# Altium schematic sheet fpgea_ep4c_f23_test.SchDoc: =GlobalProjectName
size A1; SheetNumber: Лист; SheetTotal: Листов; PageSetup: Record=PageOptions|CenterHorizontal=True|CenterVertical=True|PrintScale=1.00|XCorrection=1.00|YCorrection=1.00|PrintKind=1|BorderSize=5000000|LeftOffset=0|BottomOffset=0|Orientation=2|PaperLength=1000|PaperWidth=1000|Scale=100|PaperSource=15|PrintQuality=1200|MediaType=1|DitherType=10|PaperKind=A3|PrintScaleMode=1; Weight: -; ScaleFactor: -
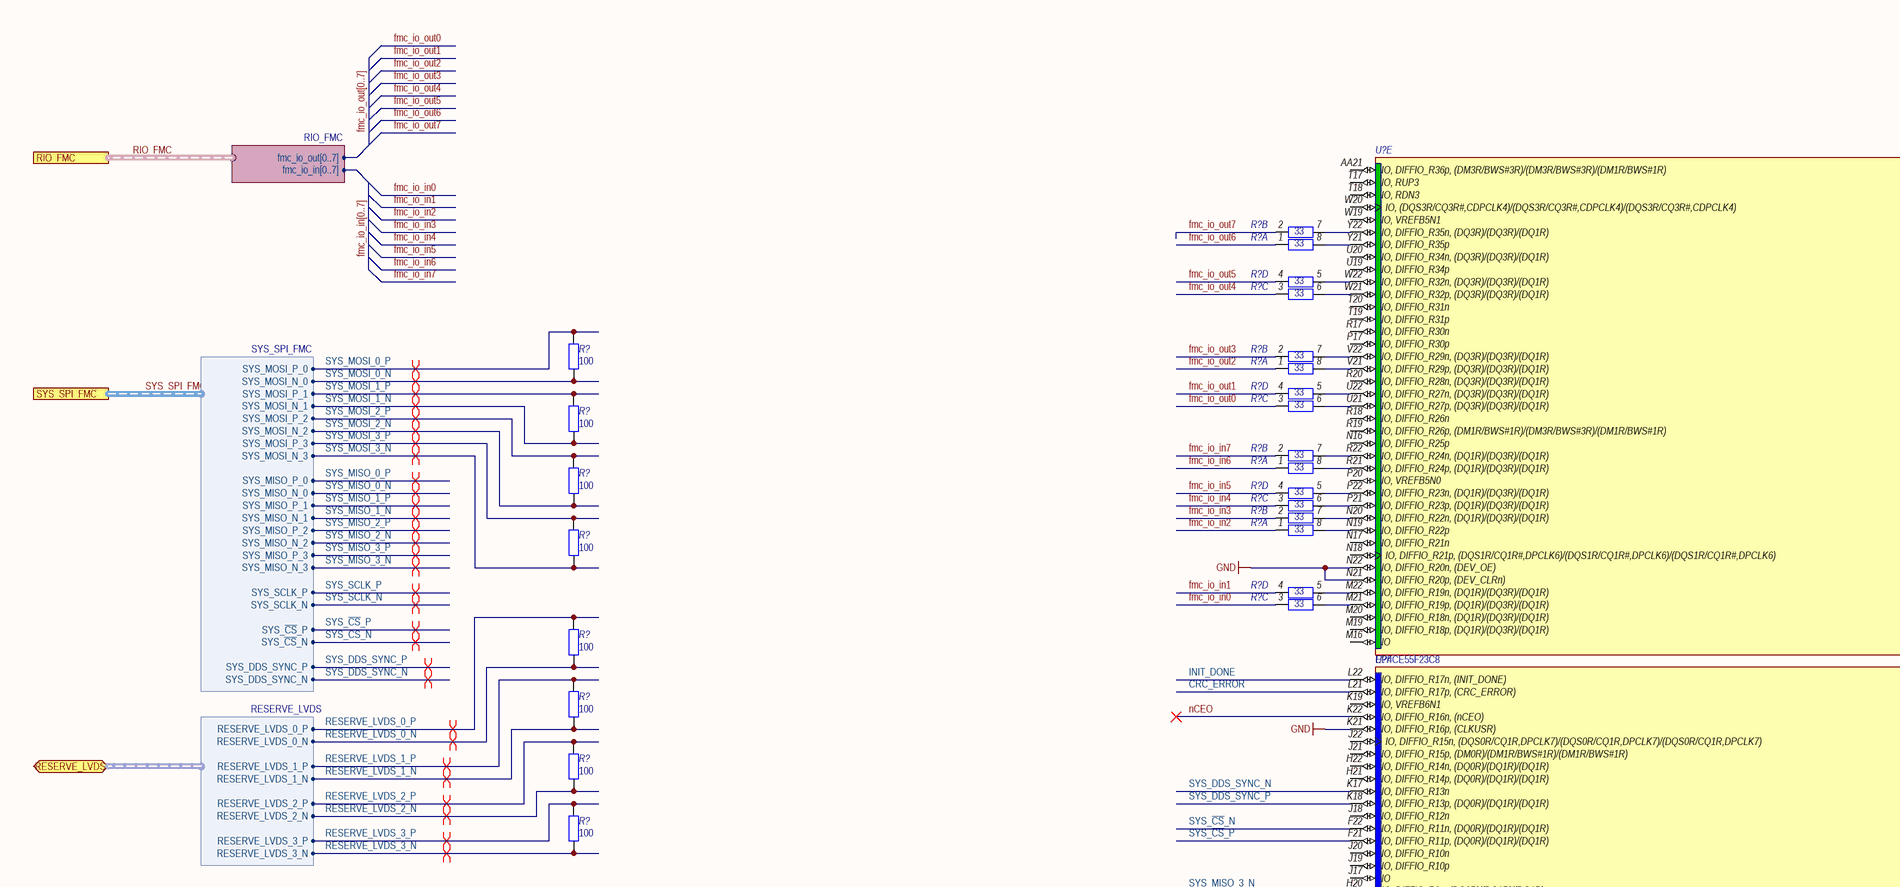
[diagram p0: fpgea_ep4c_f23_test.SchDoc, top left]
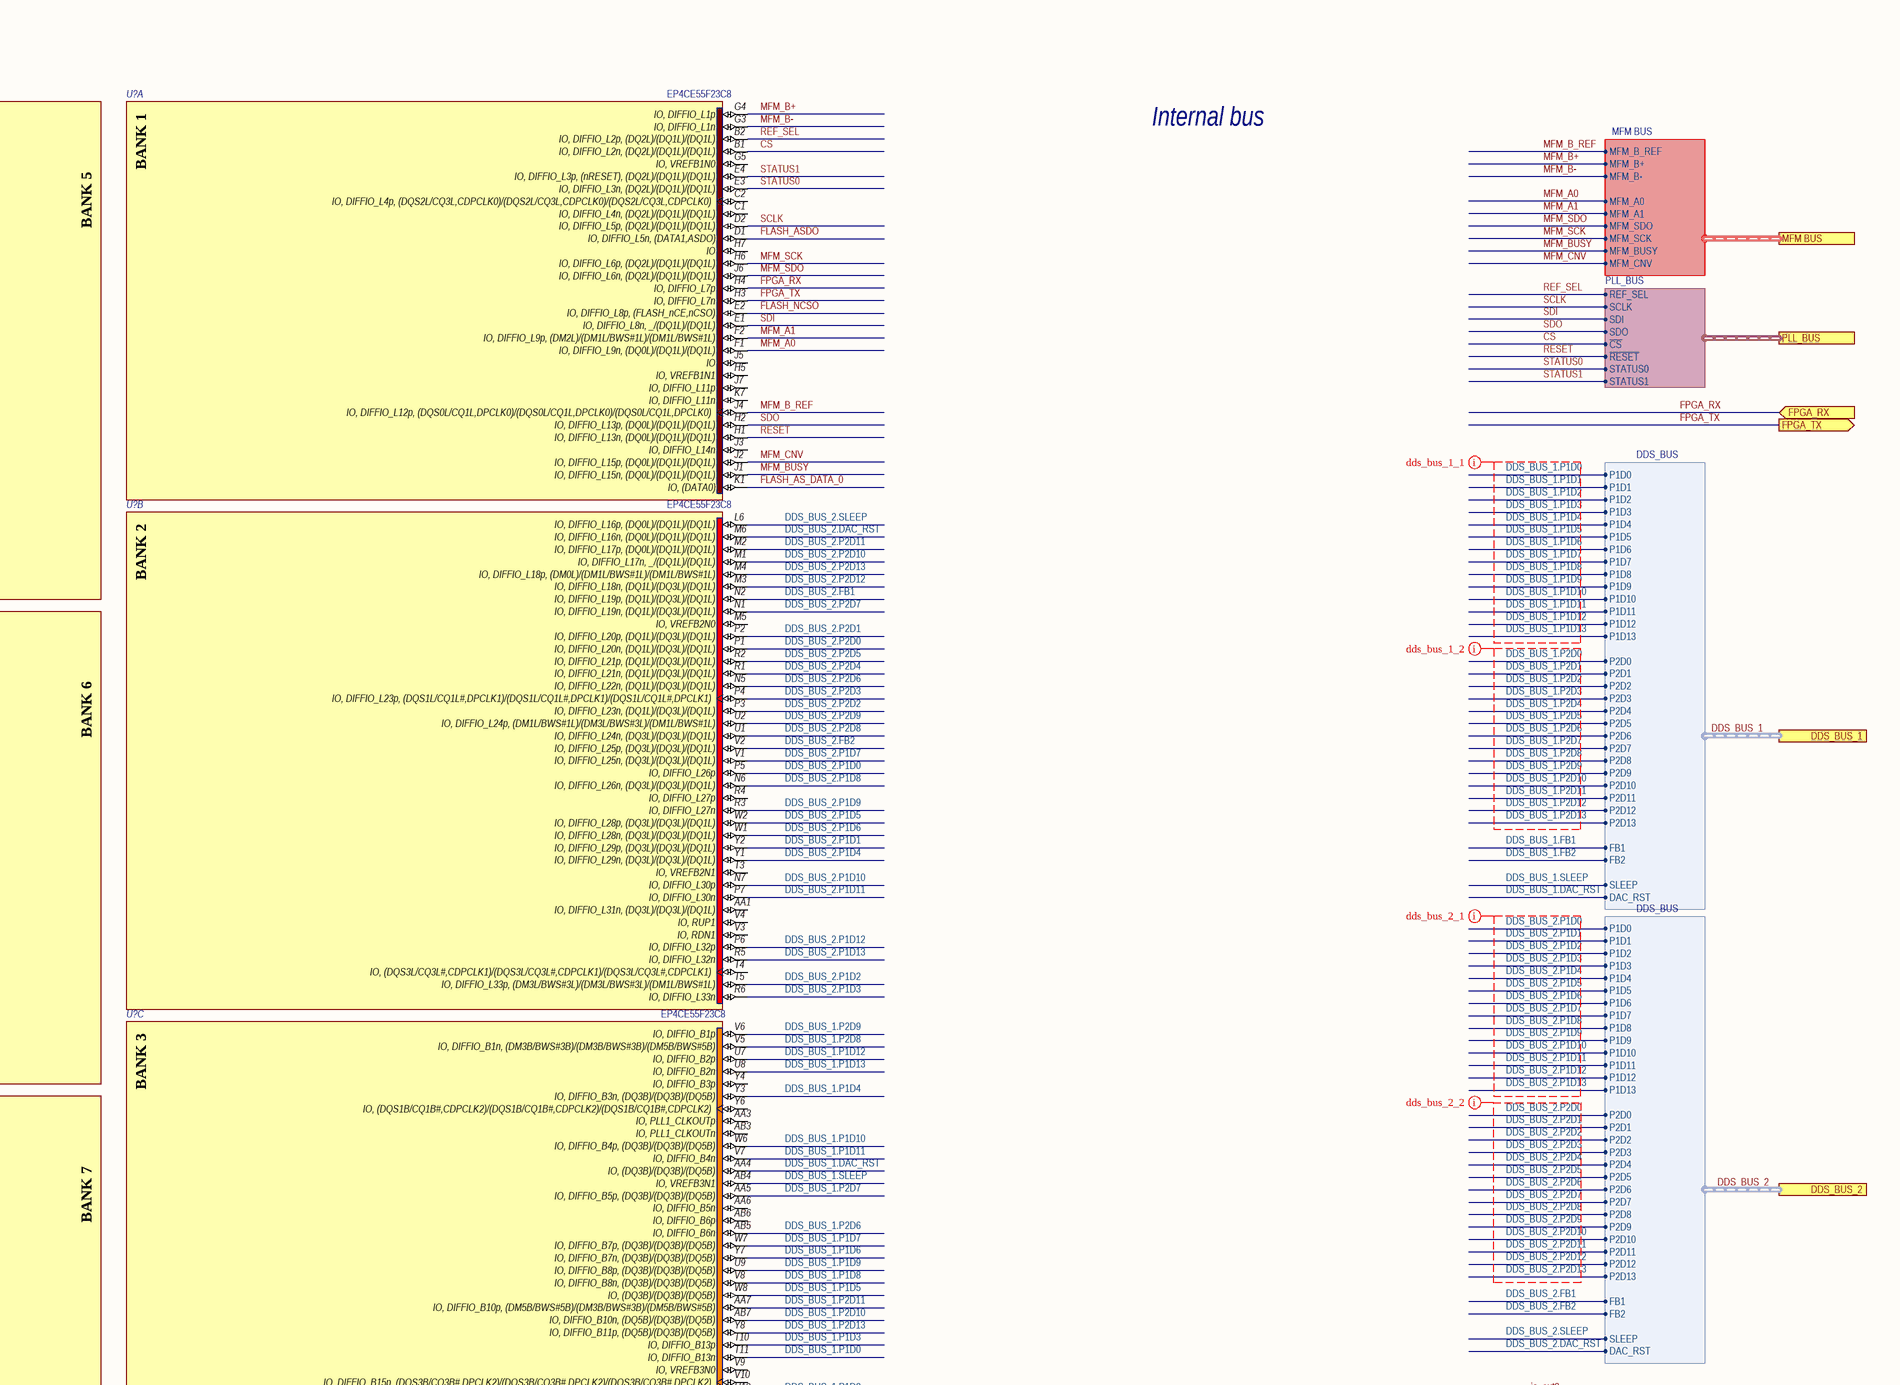
[diagram p1: fpgea_ep4c_f23_test.SchDoc, top right]
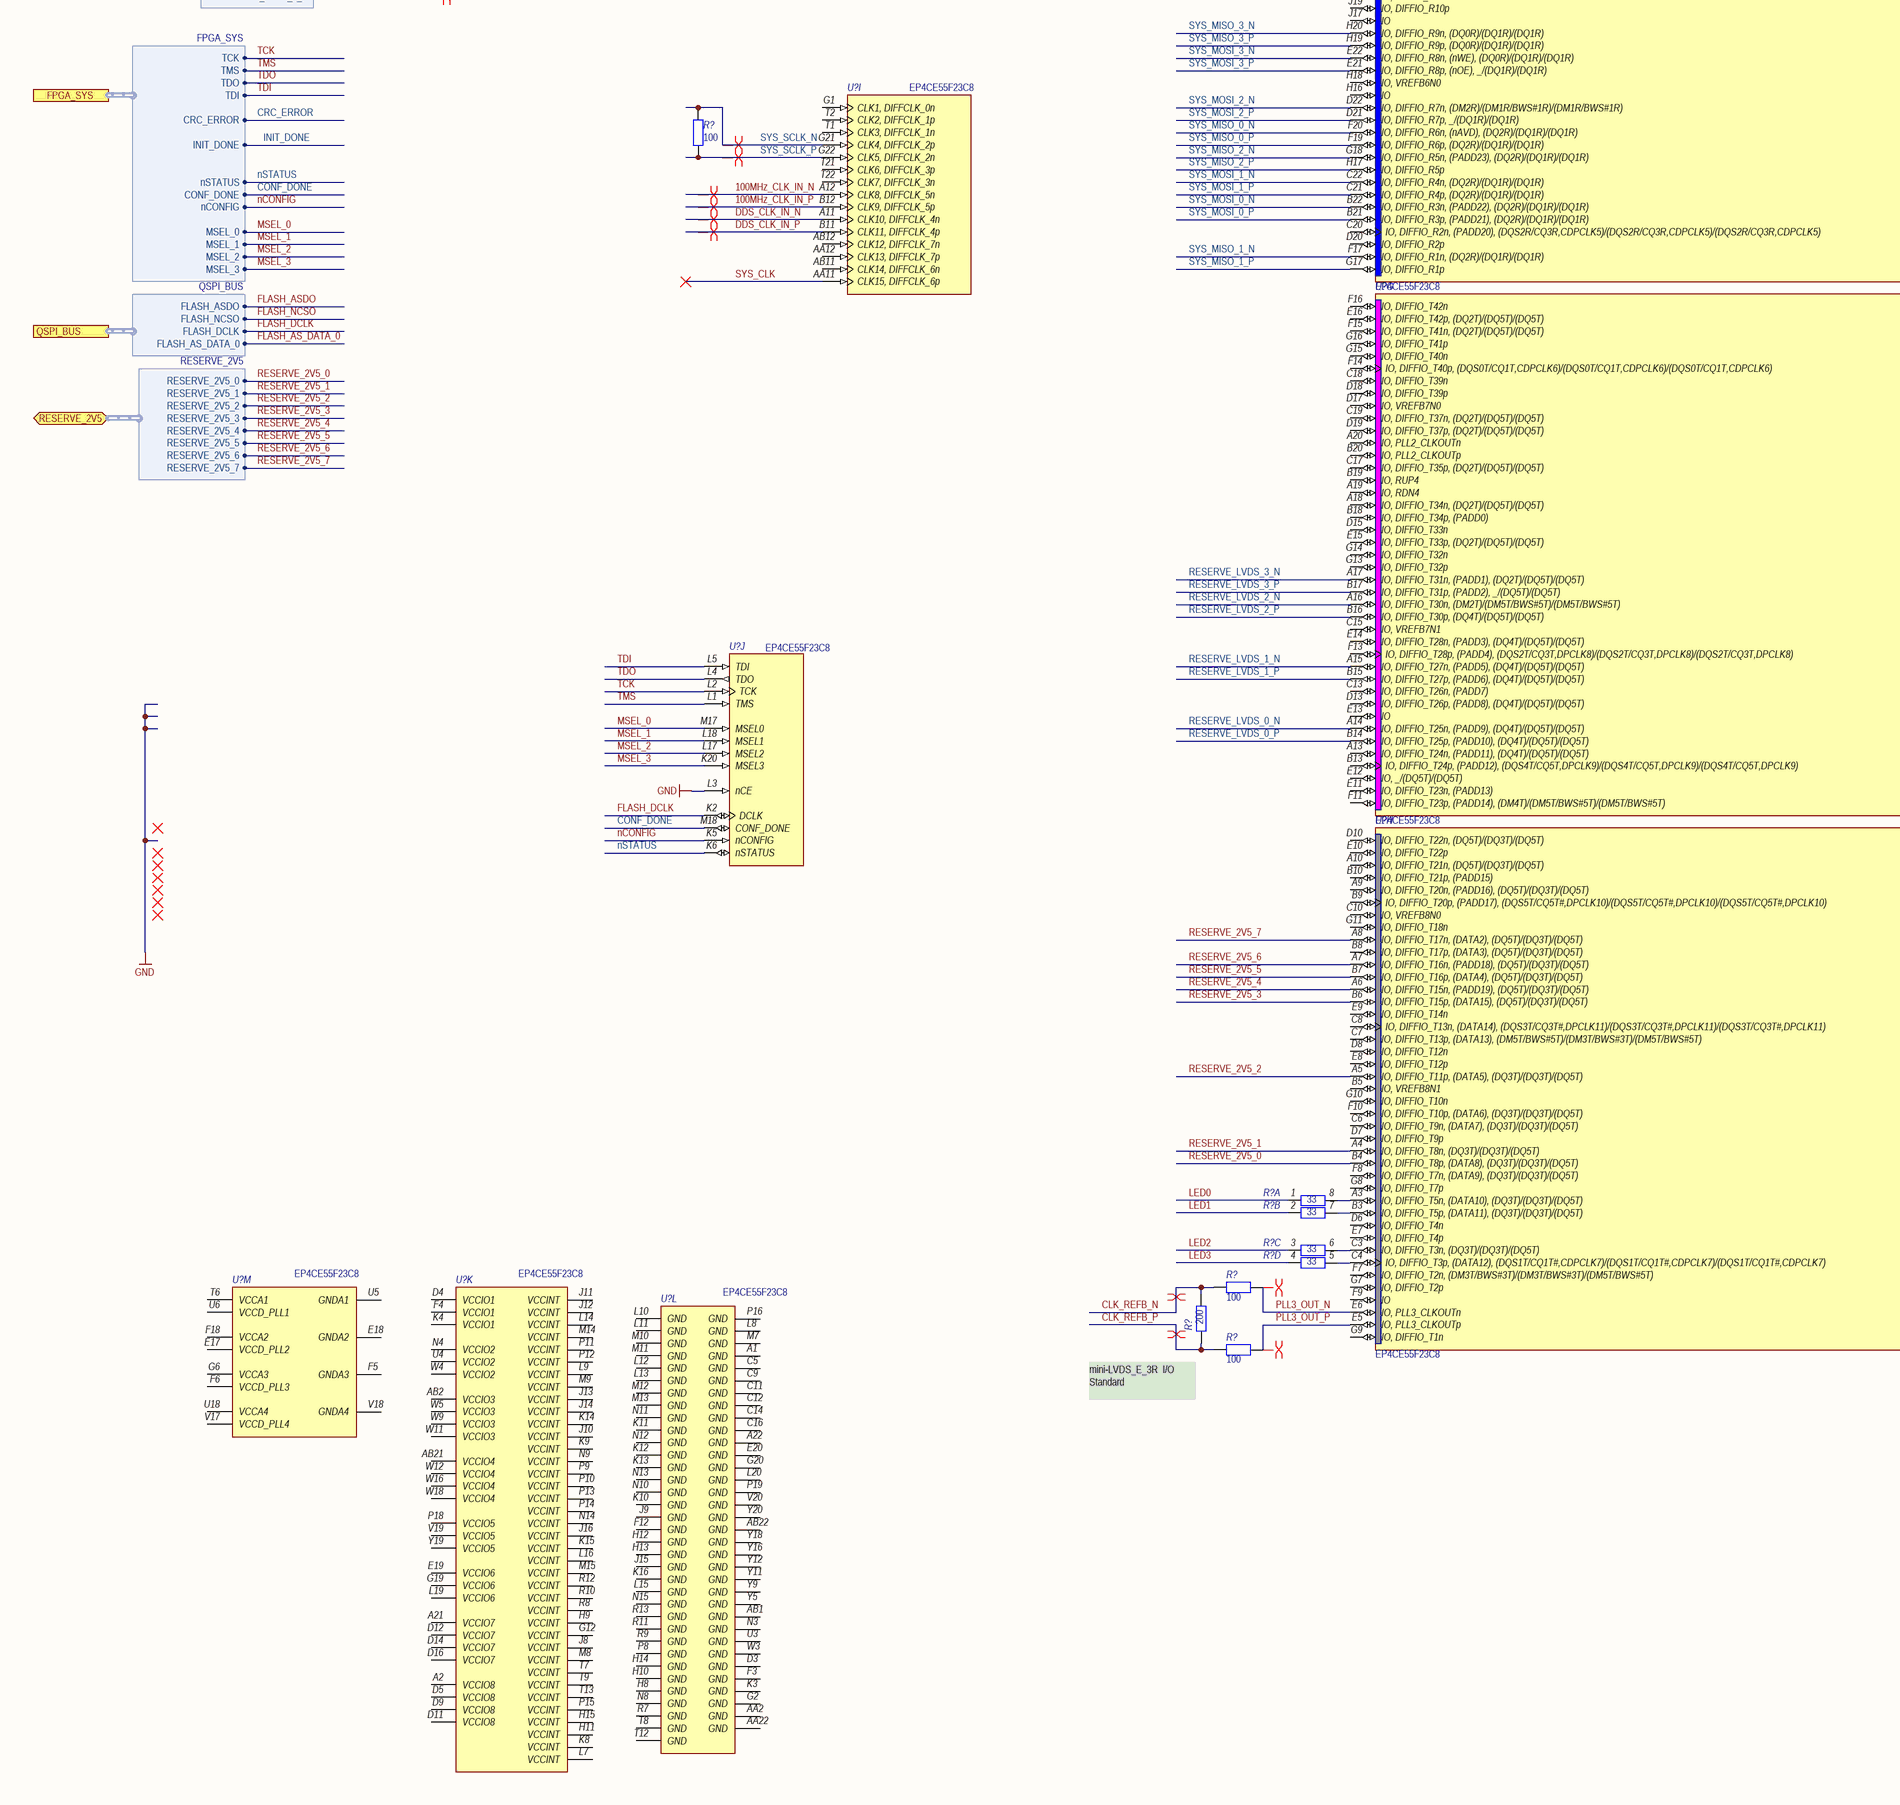
[diagram p2: fpgea_ep4c_f23_test.SchDoc, bottom left]
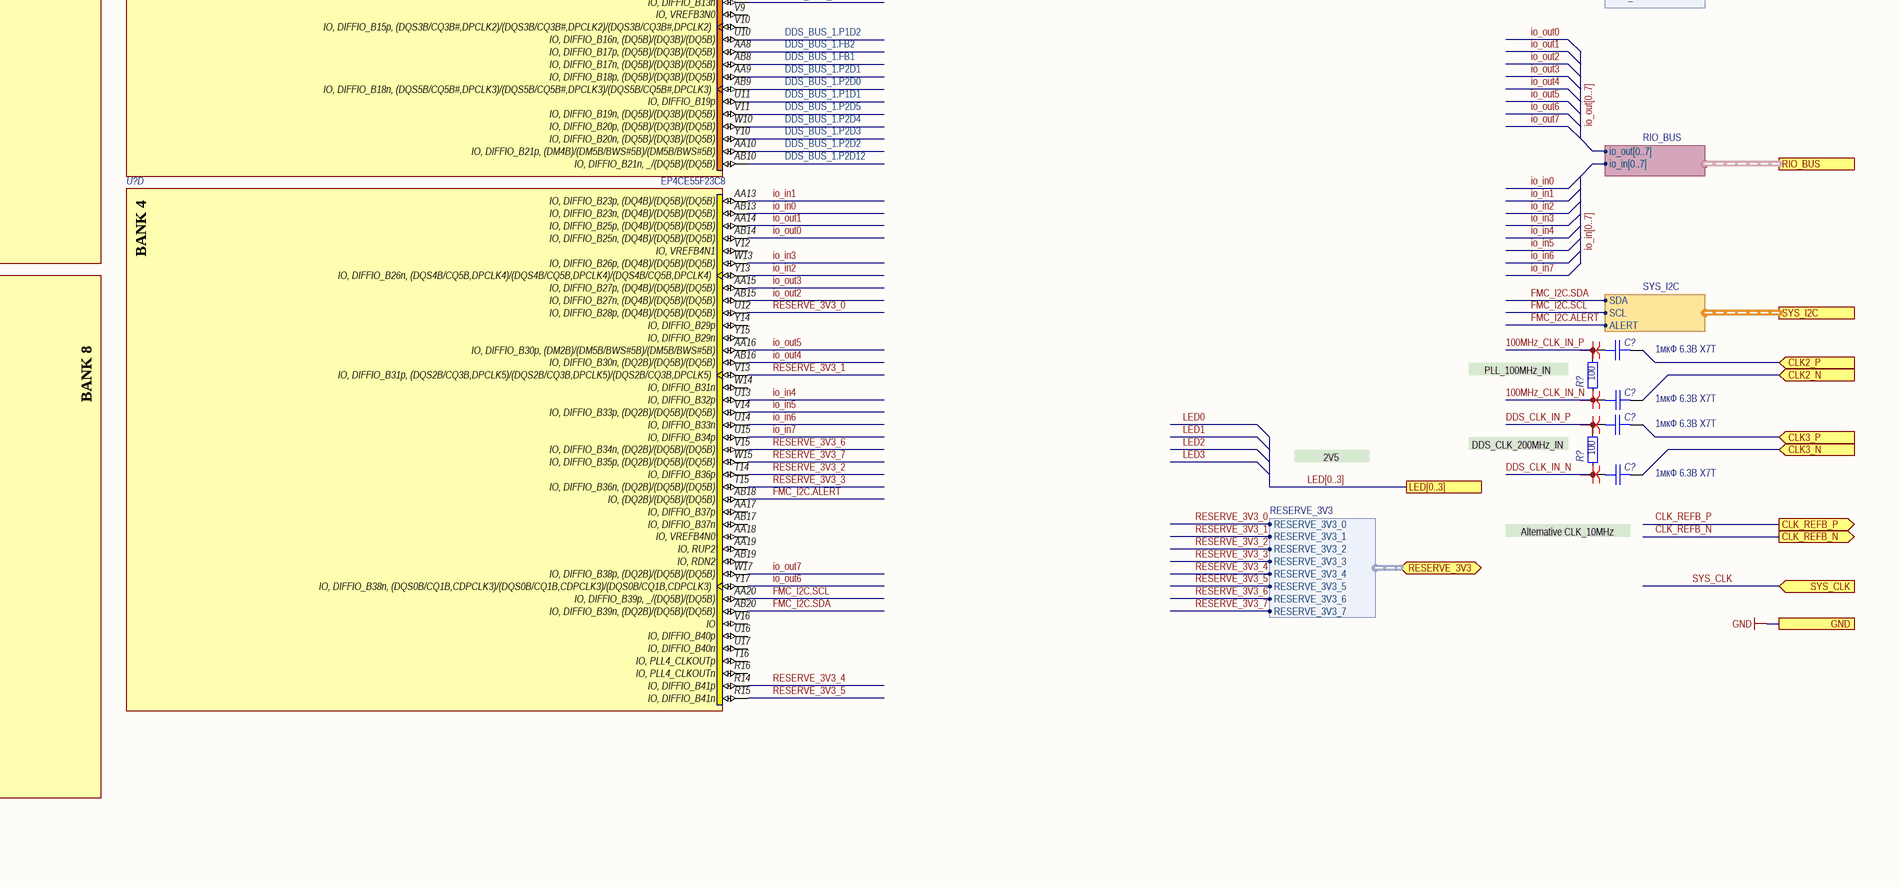
[diagram p3: fpgea_ep4c_f23_test.SchDoc, bottom right]

## Parts
(Parts that share a designator on the sheet are numbered #1, #2 ... from top to bottom, then left to right.)
C?#1  1мкФ 6.3В X7T  [SMD_C0603]
C?#2  1мкФ 6.3В X7T  [SMD_C0603]
C?#3  1мкФ 6.3В X7T  [SMD_C0603]
C?#4  1мкФ 6.3В X7T  [SMD_C0603]
R?#1  value 33  [TC124]  (hidden comment: 4 Chip Resistor Array)  (part B of 4)
R?#2  value 33  [TC124]  (hidden comment: 4 Chip Resistor Array)  (part A of 4)
R?#3  value 33  [TC124]  (hidden comment: 4 Chip Resistor Array)  (part D of 4)
R?#4  value 33  [TC124]  (hidden comment: 4 Chip Resistor Array)  (part C of 4)
R?#5  100  [SMD_0603]
R?#6  value 33  [TC124]  (hidden comment: 4 Chip Resistor Array)  (part B of 4)
R?#7  value 33  [TC124]  (hidden comment: 4 Chip Resistor Array)  (part A of 4)
R?#8  value 33  [TC124]  (hidden comment: 4 Chip Resistor Array)  (part D of 4)
R?#9  value 33  [TC124]  (hidden comment: 4 Chip Resistor Array)  (part C of 4)
R?#10  100  [SMD_0603]
R?#11  value 33  [TC124]  (hidden comment: 4 Chip Resistor Array)  (part B of 4)
R?#12  value 33  [TC124]  (hidden comment: 4 Chip Resistor Array)  (part A of 4)
R?#13  100  [SMD_0603]
R?#14  value 33  [TC124]  (hidden comment: 4 Chip Resistor Array)  (part D of 4)
R?#15  value 33  [TC124]  (hidden comment: 4 Chip Resistor Array)  (part C of 4)
R?#16  value 33  [TC124]  (hidden comment: 4 Chip Resistor Array)  (part B of 4)
R?#17  value 33  [TC124]  (hidden comment: 4 Chip Resistor Array)  (part A of 4)
R?#18  100  [SMD_0603]
R?#19  value 33  [TC124]  (hidden comment: 4 Chip Resistor Array)  (part D of 4)
R?#20  value 33  [TC124]  (hidden comment: 4 Chip Resistor Array)  (part C of 4)
R?#21  100  [SMD_0603]
R?#22  100  [SMD_0603]
R?#23  100  [SMD_0603]
R?#24  100  [SMD_0603]
R?#25  100  [SMD_0603]
R?#26  100  [SMD_0603]
R?#27  100  [SMD_0603]
R?#28  value 33  [TC124]  (hidden comment: 4 Chip Resistor Array)  (part A of 4)
R?#29  value 33  [TC124]  (hidden comment: 4 Chip Resistor Array)  (part B of 4)
R?#30  value 33  [TC124]  (hidden comment: 4 Chip Resistor Array)  (part C of 4)
R?#31  value 33  [TC124]  (hidden comment: 4 Chip Resistor Array)  (part D of 4)
R?#32  100  [SMD_0603]
R?#33  200  [SMD_0603]
R?#34  100  [SMD_0603]
U?#1  EP4CE55F23C8  [PCBComponent_1]  (part E of 13)
U?#2  EP4CE55F23C8  [PCBComponent_1]  (part A of 13)
U?#3  EP4CE55F23C8  [PCBComponent_1]  (part B of 13)
U?#4  EP4CE55F23C8  [PCBComponent_1]  (part F of 13)
U?#5  EP4CE55F23C8  [PCBComponent_1]  (part I of 13)
U?#6  EP4CE55F23C8  [PCBComponent_1]  (part C of 13)
U?#7  EP4CE55F23C8  [PCBComponent_1]  (part G of 13)
U?#8  EP4CE55F23C8  [PCBComponent_1]  (part J of 13)
U?#9  EP4CE55F23C8  [PCBComponent_1]  (part D of 13)
U?#10  EP4CE55F23C8  [PCBComponent_1]  (part H of 13)
U?#11  EP4CE55F23C8  [PCBComponent_1]  (part M of 13)
U?#12  EP4CE55F23C8  [PCBComponent_1]  (part K of 13)
U?#13  EP4CE55F23C8  [PCBComponent_1]  (part L of 13)

## Ports
CLK2_N (in), CLK2_P (in), CLK3_N (in), CLK3_P (in), CLK_REFB_N (out), CLK_REFB_P (out), DDS_BUS_1 (harness DDS_BUS), DDS_BUS_2 (harness DDS_BUS), FPGA_RX (in), FPGA_SYS (harness FPGA_SYS), FPGA_TX (out), GND, LED[0..3], MFM BUS (harness MFM BUS), PLL_BUS (harness PLL_BUS), QSPI_BUS (harness QSPI_BUS), RESERVE_2V5 (bidir, harness RESERVE_2V5), RESERVE_3V3 (bidir, harness RESERVE_3V3), RESERVE_LVDS (bidir, harness RESERVE_LVDS), RIO_BUS (harness RIO_BUS), RIO_FMC (harness RIO_FMC), SYS_CLK (in), SYS_I2C (harness SYS_I2C), SYS_SPI_FMC (harness SYS_SPI_FMC)

## Harnesses
MFM BUS: MFM_A0, MFM_A1, MFM_SDO, MFM_SCK, MFM_BUSY, MFM_CNV, MFM_B_REF, MFM_B+, MFM_B-
SYS_I2C: SDA, SCL, ALERT
PLL_BUS: REF_SEL, SCLK, SDI, SDO, ~{CS}, ~{RESET}, STATUS0, STATUS1
RIO_BUS: io_out[0..7], io_in[0..7]
RESERVE_3V3: RESERVE_3V3_0, RESERVE_3V3_1, RESERVE_3V3_2, RESERVE_3V3_3, RESERVE_3V3_4, RESERVE_3V3_5, RESERVE_3V3_6, RESERVE_3V3_7
DDS_BUS: P1D0, P1D1, P1D2, P1D3, P1D4, P1D5, P1D6, P1D7, P1D8, P1D9, P1D10, P1D11, P1D12, P1D13, P2D0, P2D1, P2D2, P2D3, P2D4, P2D5, P2D6, P2D7, P2D8, P2D9, P2D10, P2D11, P2D12, P2D13, FB1, SLEEP, DAC_RST, FB2
RIO_FMC: fmc_io_out[0..7], fmc_io_in[0..7]
FPGA_SYS: TCK, TMS, TDO, TDI, CRC_ERROR, nSTATUS, CONF_DONE, nCONFIG, MSEL_0, MSEL_1, MSEL_2, MSEL_3, INIT_DONE
SYS_SPI_FMC: SYS_MOSI_P_0, SYS_SCLK_P, SYS_~{CS}_P, SYS_MOSI_P_1, SYS_MOSI_P_2, SYS_MOSI_P_3, SYS_MOSI_N_0, SYS_MOSI_N_1, SYS_MOSI_N_2, SYS_MOSI_N_3, SYS_MISO_P_0, SYS_MISO_P_1, SYS_MISO_P_2, SYS_MISO_P_3, SYS_MISO_N_0, SYS_MISO_N_1, SYS_MISO_N_2, SYS_MISO_N_3, SYS_SCLK_N, SYS_DDS_SYNC_P, SYS_~{CS}_N, SYS_DDS_SYNC_N
RESERVE_LVDS: RESERVE_LVDS_0_P, RESERVE_LVDS_0_N, RESERVE_LVDS_1_P, RESERVE_LVDS_1_N, RESERVE_LVDS_2_P, RESERVE_LVDS_2_N, RESERVE_LVDS_3_P, RESERVE_LVDS_3_N
QSPI_BUS: FLASH_ASDO, FLASH_NCSO, FLASH_DCLK, FLASH_AS_DATA_0
RESERVE_2V5: RESERVE_2V5_0, RESERVE_2V5_1, RESERVE_2V5_2, RESERVE_2V5_3, RESERVE_2V5_4, RESERVE_2V5_5, RESERVE_2V5_6, RESERVE_2V5_7

## Nets
GND: U?#1.N21(IO,_DIFFIO_R20p,_(DEV_CLRn)) U?#1.N22(IO,_DIFFIO_R20n,_(DEV_OE)) U?#4.K21(IO,_DIFFIO_R16p,_(CLKUSR)) U?#8.L3(nCE) ; port GND
100MHz_CLK_IN_N: C?#2.1 R?#26.1 U?#5.A12(CLK8,_DIFFCLK_5n)
100MHz_CLK_IN_P: C?#1.2 R?#26.2 U?#5.B12(CLK9,_DIFFCLK_5p)
~{CS}: U?#2.B1(IO,_DIFFIO_L2n,_(DQ2L)/(DQ1L)/(DQ1L)) ; port PLL_BUS.~{CS}
CLK2_N: C?#2.2 ; port CLK2_N
CLK2_P: C?#1.1 ; port CLK2_P
CLK3_N: C?#4.2 ; port CLK3_N
CLK3_P: C?#3.1 ; port CLK3_P
CLK_REFB_N: R?#32.2 R?#33.2 ; port CLK_REFB_N
CLK_REFB_P: R?#33.1 R?#34.2 ; port CLK_REFB_P
CONF_DONE: U?#8.M18(CONF_DONE) ; port FPGA_SYS.CONF_DONE
CRC_ERROR: U?#4.L21(IO,_DIFFIO_R17p,_(CRC_ERROR)) ; port FPGA_SYS.CRC_ERROR
DDS_BUS_1.DAC_RST: U?#6.AA4(IO,_(DQ3B)/(DQ3B)/(DQ5B)) ; port DDS_BUS_1.DAC_RST
DDS_BUS_1.FB1: U?#6.AB8(IO,_DIFFIO_B17n,_(DQ5B)/(DQ3B)/(DQ5B)) ; port DDS_BUS_1.FB1
DDS_BUS_1.FB2: U?#6.AA8(IO,_DIFFIO_B17p,_(DQ5B)/(DQ3B)/(DQ5B)) ; port DDS_BUS_1.FB2
DDS_BUS_1.P1D0: U?#6.T11(IO,_DIFFIO_B13n) ; port DDS_BUS_1.P1D0
DDS_BUS_1.P1D1: U?#6.U11(IO,_DIFFIO_B19p) ; port DDS_BUS_1.P1D1
DDS_BUS_1.P1D2: U?#6.U10(IO,_DIFFIO_B16n,_(DQ5B)/(DQ3B)/(DQ5B)) ; port DDS_BUS_1.P1D2
DDS_BUS_1.P1D3: U?#6.T10(IO,_DIFFIO_B13p) ; port DDS_BUS_1.P1D3
DDS_BUS_1.P1D4: U?#6.Y3(IO,_DIFFIO_B3n,_(DQ3B)/(DQ3B)/(DQ5B)) ; port DDS_BUS_1.P1D4
DDS_BUS_1.P1D5: U?#6.W8(IO,_(DQ3B)/(DQ3B)/(DQ5B)) ; port DDS_BUS_1.P1D5
DDS_BUS_1.P1D6: U?#6.Y7(IO,_DIFFIO_B7n,_(DQ3B)/(DQ3B)/(DQ5B)) ; port DDS_BUS_1.P1D6
DDS_BUS_1.P1D7: U?#6.W7(IO,_DIFFIO_B7p,_(DQ3B)/(DQ3B)/(DQ5B)) ; port DDS_BUS_1.P1D7
DDS_BUS_1.P1D8: U?#6.V8(IO,_DIFFIO_B8n,_(DQ3B)/(DQ3B)/(DQ5B)) ; port DDS_BUS_1.P1D8
DDS_BUS_1.P1D9: U?#6.U9(IO,_DIFFIO_B8p,_(DQ3B)/(DQ3B)/(DQ5B)) ; port DDS_BUS_1.P1D9
DDS_BUS_1.P1D10: U?#6.W6(IO,_DIFFIO_B4p,_(DQ3B)/(DQ3B)/(DQ5B)) ; port DDS_BUS_1.P1D10
DDS_BUS_1.P1D11: U?#6.V7(IO,_DIFFIO_B4n) ; port DDS_BUS_1.P1D11
DDS_BUS_1.P1D12: U?#6.U7(IO,_DIFFIO_B2p) ; port DDS_BUS_1.P1D12
DDS_BUS_1.P1D13: U?#6.U8(IO,_DIFFIO_B2n) ; port DDS_BUS_1.P1D13
DDS_BUS_1.P2D0: U?#6.AB9(IO,_DIFFIO_B18n,_(DQS5B/CQ5B#,DPCLK3)/(DQS5B/CQ5B#,DPCLK3)/(DQS5B/CQ5B#,DPCLK3)) ; port DDS_BUS_1.P2D0
DDS_BUS_1.P2D1: U?#6.AA9(IO,_DIFFIO_B18p,_(DQ5B)/(DQ3B)/(DQ5B)) ; port DDS_BUS_1.P2D1
DDS_BUS_1.P2D2: U?#6.AA10(IO,_DIFFIO_B21p,_(DM4B)/(DM5B/BWS#5B)/(DM5B/BWS#5B)) ; port DDS_BUS_1.P2D2
DDS_BUS_1.P2D3: U?#6.Y10(IO,_DIFFIO_B20n,_(DQ5B)/(DQ3B)/(DQ5B)) ; port DDS_BUS_1.P2D3
DDS_BUS_1.P2D4: U?#6.W10(IO,_DIFFIO_B20p,_(DQ5B)/(DQ3B)/(DQ5B)) ; port DDS_BUS_1.P2D4
DDS_BUS_1.P2D5: U?#6.V11(IO,_DIFFIO_B19n,_(DQ5B)/(DQ3B)/(DQ5B)) ; port DDS_BUS_1.P2D5
DDS_BUS_1.P2D6: U?#6.AB5(IO,_DIFFIO_B6n) ; port DDS_BUS_1.P2D6
DDS_BUS_1.P2D7: U?#6.AA5(IO,_DIFFIO_B5p,_(DQ3B)/(DQ3B)/(DQ5B)) ; port DDS_BUS_1.P2D7
DDS_BUS_1.P2D8: U?#6.V5(IO,_DIFFIO_B1n,_(DM3B/BWS#3B)/(DM3B/BWS#3B)/(DM5B/BWS#5B)) ; port DDS_BUS_1.P2D8
DDS_BUS_1.P2D9: U?#6.V6(IO,_DIFFIO_B1p) ; port DDS_BUS_1.P2D9
DDS_BUS_1.P2D10: U?#6.AB7(IO,_DIFFIO_B10n,_(DQ5B)/(DQ3B)/(DQ5B)) ; port DDS_BUS_1.P2D10
DDS_BUS_1.P2D11: U?#6.AA7(IO,_DIFFIO_B10p,_(DM5B/BWS#5B)/(DM3B/BWS#3B)/(DM5B/BWS#5B)) ; port DDS_BUS_1.P2D11
DDS_BUS_1.P2D12: U?#6.AB10(IO,_DIFFIO_B21n,__/(DQ5B)/(DQ5B)) ; port DDS_BUS_1.P2D12
DDS_BUS_1.P2D13: U?#6.Y8(IO,_DIFFIO_B11p,_(DQ5B)/(DQ3B)/(DQ5B)) ; port DDS_BUS_1.P2D13
DDS_BUS_1.SLEEP: U?#6.AB4(IO,_VREFB3N1) ; port DDS_BUS_1.SLEEP
DDS_BUS_2.DAC_RST: U?#3.M6(IO,_DIFFIO_L16n,_(DQ0L)/(DQ1L)/(DQ1L)) ; port DDS_BUS_2.DAC_RST
DDS_BUS_2.FB1: U?#3.N2(IO,_DIFFIO_L19p,_(DQ1L)/(DQ3L)/(DQ1L)) ; port DDS_BUS_2.FB1
DDS_BUS_2.FB2: U?#3.V2(IO,_DIFFIO_L25p,_(DQ3L)/(DQ3L)/(DQ1L)) ; port DDS_BUS_2.FB2
DDS_BUS_2.P1D0: U?#3.P5(IO,_DIFFIO_L26p) ; port DDS_BUS_2.P1D0
DDS_BUS_2.P1D1: U?#3.Y2(IO,_DIFFIO_L29p,_(DQ3L)/(DQ3L)/(DQ1L)) ; port DDS_BUS_2.P1D1
DDS_BUS_2.P1D2: U?#3.T5(IO,_DIFFIO_L33p,_(DM3L/BWS#3L)/(DM3L/BWS#3L)/(DM1L/BWS#1L)) ; port DDS_BUS_2.P1D2
DDS_BUS_2.P1D3: U?#3.R6(IO,_DIFFIO_L33n) ; port DDS_BUS_2.P1D3
DDS_BUS_2.P1D4: U?#3.Y1(IO,_DIFFIO_L29n,_(DQ3L)/(DQ3L)/(DQ1L)) ; port DDS_BUS_2.P1D4
DDS_BUS_2.P1D5: U?#3.W2(IO,_DIFFIO_L28p,_(DQ3L)/(DQ3L)/(DQ1L)) ; port DDS_BUS_2.P1D5
DDS_BUS_2.P1D6: U?#3.W1(IO,_DIFFIO_L28n,_(DQ3L)/(DQ3L)/(DQ1L)) ; port DDS_BUS_2.P1D6
DDS_BUS_2.P1D7: U?#3.V1(IO,_DIFFIO_L25n,_(DQ3L)/(DQ3L)/(DQ1L)) ; port DDS_BUS_2.P1D7
DDS_BUS_2.P1D8: U?#3.N6(IO,_DIFFIO_L26n,_(DQ3L)/(DQ3L)/(DQ1L)) ; port DDS_BUS_2.P1D8
DDS_BUS_2.P1D9: U?#3.R3(IO,_DIFFIO_L27n) ; port DDS_BUS_2.P1D9
DDS_BUS_2.P1D10: U?#3.N7(IO,_DIFFIO_L30p) ; port DDS_BUS_2.P1D10
DDS_BUS_2.P1D11: U?#3.P7(IO,_DIFFIO_L30n) ; port DDS_BUS_2.P1D11
DDS_BUS_2.P1D12: U?#3.P6(IO,_DIFFIO_L32p) ; port DDS_BUS_2.P1D12
DDS_BUS_2.P1D13: U?#3.R5(IO,_DIFFIO_L32n) ; port DDS_BUS_2.P1D13
DDS_BUS_2.P2D0: U?#3.P1(IO,_DIFFIO_L20n,_(DQ1L)/(DQ3L)/(DQ1L)) ; port DDS_BUS_2.P2D0
DDS_BUS_2.P2D1: U?#3.P2(IO,_DIFFIO_L20p,_(DQ1L)/(DQ3L)/(DQ1L)) ; port DDS_BUS_2.P2D1
DDS_BUS_2.P2D2: U?#3.P3(IO,_DIFFIO_L23n,_(DQ1L)/(DQ3L)/(DQ1L)) ; port DDS_BUS_2.P2D2
DDS_BUS_2.P2D3: U?#3.P4(IO,_DIFFIO_L23p,_(DQS1L/CQ1L#,DPCLK1)/(DQS1L/CQ1L#,DPCLK1)/(DQS1L/CQ1L#,DPCLK1)) ; port DDS_BUS_2.P2D3
DDS_BUS_2.P2D4: U?#3.R1(IO,_DIFFIO_L21n,_(DQ1L)/(DQ3L)/(DQ1L)) ; port DDS_BUS_2.P2D4
DDS_BUS_2.P2D5: U?#3.R2(IO,_DIFFIO_L21p,_(DQ1L)/(DQ3L)/(DQ1L)) ; port DDS_BUS_2.P2D5
DDS_BUS_2.P2D6: U?#3.N5(IO,_DIFFIO_L22n,_(DQ1L)/(DQ3L)/(DQ1L)) ; port DDS_BUS_2.P2D6
DDS_BUS_2.P2D7: U?#3.N1(IO,_DIFFIO_L19n,_(DQ1L)/(DQ3L)/(DQ1L)) ; port DDS_BUS_2.P2D7
DDS_BUS_2.P2D8: U?#3.U1(IO,_DIFFIO_L24n,_(DQ3L)/(DQ3L)/(DQ1L)) ; port DDS_BUS_2.P2D8
DDS_BUS_2.P2D9: U?#3.U2(IO,_DIFFIO_L24p,_(DM1L/BWS#1L)/(DM3L/BWS#3L)/(DM1L/BWS#1L)) ; port DDS_BUS_2.P2D9
DDS_BUS_2.P2D10: U?#3.M1(IO,_DIFFIO_L17n,__/(DQ1L)/(DQ1L)) ; port DDS_BUS_2.P2D10
DDS_BUS_2.P2D11: U?#3.M2(IO,_DIFFIO_L17p,_(DQ0L)/(DQ1L)/(DQ1L)) ; port DDS_BUS_2.P2D11
DDS_BUS_2.P2D12: U?#3.M3(IO,_DIFFIO_L18n,_(DQ1L)/(DQ3L)/(DQ1L)) ; port DDS_BUS_2.P2D12
DDS_BUS_2.P2D13: U?#3.M4(IO,_DIFFIO_L18p,_(DM0L)/(DM1L/BWS#1L)/(DM1L/BWS#1L)) ; port DDS_BUS_2.P2D13
DDS_BUS_2.SLEEP: U?#3.L6(IO,_DIFFIO_L16p,_(DQ0L)/(DQ1L)/(DQ1L)) ; port DDS_BUS_2.SLEEP
DDS_CLK_IN_N: C?#4.1 R?#27.1 U?#5.A11(CLK10,_DIFFCLK_4n)
DDS_CLK_IN_P: C?#3.2 R?#27.2 U?#5.B11(CLK11,_DIFFCLK_4p)
FLASH_AS_DATA_0: U?#2.K1(IO,_(DATA0)) ; port QSPI_BUS.FLASH_AS_DATA_0
FLASH_ASDO: U?#2.D1(IO,_DIFFIO_L5n,_(DATA1,ASDO)) ; port QSPI_BUS.FLASH_ASDO
FLASH_DCLK: U?#8.K2(DCLK) ; port QSPI_BUS.FLASH_DCLK
FLASH_NCSO: U?#2.E2(IO,_DIFFIO_L8p,_(FLASH_nCE,nCSO)) ; port QSPI_BUS.FLASH_NCSO
FMC_I2C.ALERT: U?#9.AB18(IO,_(DQ2B)/(DQ5B)/(DQ5B)) ; port SYS_I2C.ALERT
FMC_I2C.SCL: U?#9.AA20(IO,_DIFFIO_B39p,__/(DQ5B)/(DQ5B)) ; port SYS_I2C.SCL
FMC_I2C.SDA: U?#9.AB20(IO,_DIFFIO_B39n,_(DQ2B)/(DQ5B)/(DQ5B)) ; port SYS_I2C.SDA
fmc_io_in0: R?#20.3
fmc_io_in1: R?#19.4
fmc_io_in2: R?#17.1
fmc_io_in3: R?#16.2
fmc_io_in4: R?#15.3
fmc_io_in5: R?#14.4
fmc_io_in6: R?#12.1
fmc_io_in7: R?#11.2
fmc_io_out0: R?#9.3
fmc_io_out1: R?#8.4
fmc_io_out2: R?#7.1
fmc_io_out3: R?#6.2
fmc_io_out4: R?#4.3
fmc_io_out5: R?#3.4
fmc_io_out6: R?#2.1
fmc_io_out7: R?#1.2
FPGA_RX: U?#2.H4(IO,_DIFFIO_L7p) ; port FPGA_RX
FPGA_TX: U?#2.H3(IO,_DIFFIO_L7n) ; port FPGA_TX
INIT_DONE: U?#4.L22(IO,_DIFFIO_R17n,_(INIT_DONE)) ; port FPGA_SYS.INIT_DONE
io_in0: U?#9.AB13(IO,_DIFFIO_B23n,_(DQ4B)/(DQ5B)/(DQ5B))
io_in1: U?#9.AA13(IO,_DIFFIO_B23p,_(DQ4B)/(DQ5B)/(DQ5B))
io_in2: U?#9.Y13(IO,_DIFFIO_B26n,_(DQS4B/CQ5B,DPCLK4)/(DQS4B/CQ5B,DPCLK4)/(DQS4B/CQ5B,DPCLK4))
io_in3: U?#9.W13(IO,_DIFFIO_B26p,_(DQ4B)/(DQ5B)/(DQ5B))
io_in4: U?#9.U13(IO,_DIFFIO_B32p)
io_in5: U?#9.V14(IO,_DIFFIO_B33p,_(DQ2B)/(DQ5B)/(DQ5B))
io_in6: U?#9.U14(IO,_DIFFIO_B33n)
io_in7: U?#9.U15(IO,_DIFFIO_B34p)
io_out0: U?#9.AB14(IO,_DIFFIO_B25n,_(DQ4B)/(DQ5B)/(DQ5B))
io_out1: U?#9.AA14(IO,_DIFFIO_B25p,_(DQ4B)/(DQ5B)/(DQ5B))
io_out2: U?#9.AB15(IO,_DIFFIO_B27n,_(DQ4B)/(DQ5B)/(DQ5B))
io_out3: U?#9.AA15(IO,_DIFFIO_B27p,_(DQ4B)/(DQ5B)/(DQ5B))
io_out4: U?#9.AB16(IO,_DIFFIO_B30n,_(DQ2B)/(DQ5B)/(DQ5B))
io_out5: U?#9.AA16(IO,_DIFFIO_B30p,_(DM2B)/(DM5B/BWS#5B)/(DM5B/BWS#5B))
io_out6: U?#9.Y17(IO,_DIFFIO_B38n,_(DQS0B/CQ1B,CDPCLK3)/(DQS0B/CQ1B,CDPCLK3)/(DQS0B/CQ1B,CDPCLK3))
io_out7: U?#9.W17(IO,_DIFFIO_B38p,_(DQ2B)/(DQ5B)/(DQ5B))
LED0: R?#28.1
LED1: R?#29.2
LED2: R?#30.3
LED3: R?#31.4
MFM_A0: U?#2.F1(IO,_DIFFIO_L9n,_(DQ0L)/(DQ1L)/(DQ1L)) ; port MFM BUS.MFM_A0
MFM_A1: U?#2.F2(IO,_DIFFIO_L9p,_(DM2L)/(DM1L/BWS#1L)/(DM1L/BWS#1L)) ; port MFM BUS.MFM_A1
MFM_B+: U?#2.G4(IO,_DIFFIO_L1p) ; port MFM BUS.MFM_B+
MFM_B-: U?#2.G3(IO,_DIFFIO_L1n) ; port MFM BUS.MFM_B-
MFM_B_REF: U?#2.J4(IO,_DIFFIO_L12p,_(DQS0L/CQ1L,DPCLK0)/(DQS0L/CQ1L,DPCLK0)/(DQS0L/CQ1L,DPCLK0)) ; port MFM BUS.MFM_B_REF
MFM_BUSY: U?#2.J1(IO,_DIFFIO_L15n,_(DQ0L)/(DQ1L)/(DQ1L)) ; port MFM BUS.MFM_BUSY
MFM_CNV: U?#2.J2(IO,_DIFFIO_L15p,_(DQ0L)/(DQ1L)/(DQ1L)) ; port MFM BUS.MFM_CNV
MFM_SCK: U?#2.H6(IO,_DIFFIO_L6p,_(DQ2L)/(DQ1L)/(DQ1L)) ; port MFM BUS.MFM_SCK
MFM_SDO: U?#2.J6(IO,_DIFFIO_L6n,_(DQ2L)/(DQ1L)/(DQ1L)) ; port MFM BUS.MFM_SDO
MSEL_0: U?#8.M17(MSEL0) ; port FPGA_SYS.MSEL_0
MSEL_1: U?#8.L18(MSEL1) ; port FPGA_SYS.MSEL_1
MSEL_2: U?#8.L17(MSEL2) ; port FPGA_SYS.MSEL_2
MSEL_3: U?#8.K20(MSEL3) ; port FPGA_SYS.MSEL_3
nCEO: U?#4.K22(IO,_DIFFIO_R16n,_(nCEO))
nCONFIG: U?#8.K5(nCONFIG) ; port FPGA_SYS.nCONFIG
nSTATUS: U?#8.K6(nSTATUS) ; port FPGA_SYS.nSTATUS
PLL3_OUT_N: R?#32.1 U?#10.E6(IO,_PLL3_CLKOUTn)
PLL3_OUT_P: R?#34.1 U?#10.E5(IO,_PLL3_CLKOUTp)
~{RESET}: U?#2.H1(IO,_DIFFIO_L13n,_(DQ0L)/(DQ1L)/(DQ1L)) ; port PLL_BUS.~{RESET}
REF_SEL: U?#2.B2(IO,_DIFFIO_L2p,_(DQ2L)/(DQ1L)/(DQ1L)) ; port PLL_BUS.REF_SEL
RESERVE_2V5_0: U?#10.B4(IO,_DIFFIO_T8p,_(DATA8),_(DQ3T)/(DQ3T)/(DQ5T)) ; port RESERVE_2V5.RESERVE_2V5_0
RESERVE_2V5_1: U?#10.A4(IO,_DIFFIO_T8n,_(DQ3T)/(DQ3T)/(DQ5T)) ; port RESERVE_2V5.RESERVE_2V5_1
RESERVE_2V5_2: U?#10.A5(IO,_DIFFIO_T11p,_(DATA5),_(DQ3T)/(DQ3T)/(DQ5T)) ; port RESERVE_2V5.RESERVE_2V5_2
RESERVE_2V5_3: U?#10.B6(IO,_DIFFIO_T15p,_(DATA15),_(DQ5T)/(DQ3T)/(DQ5T)) ; port RESERVE_2V5.RESERVE_2V5_3
RESERVE_2V5_4: U?#10.A6(IO,_DIFFIO_T15n,_(PADD19),_(DQ5T)/(DQ3T)/(DQ5T)) ; port RESERVE_2V5.RESERVE_2V5_4
RESERVE_2V5_5: U?#10.B7(IO,_DIFFIO_T16p,_(DATA4),_(DQ5T)/(DQ3T)/(DQ5T)) ; port RESERVE_2V5.RESERVE_2V5_5
RESERVE_2V5_6: U?#10.A7(IO,_DIFFIO_T16n,_(PADD18),_(DQ5T)/(DQ3T)/(DQ5T)) ; port RESERVE_2V5.RESERVE_2V5_6
RESERVE_2V5_7: U?#10.A8(IO,_DIFFIO_T17n,_(DATA2),_(DQ5T)/(DQ3T)/(DQ5T)) ; port RESERVE_2V5.RESERVE_2V5_7
RESERVE_3V3_0: U?#9.U12(IO,_DIFFIO_B28p,_(DQ4B)/(DQ5B)/(DQ5B)) ; port RESERVE_3V3.RESERVE_3V3_0
RESERVE_3V3_1: U?#9.V13(IO,_DIFFIO_B31p,_(DQS2B/CQ3B,DPCLK5)/(DQS2B/CQ3B,DPCLK5)/(DQS2B/CQ3B,DPCLK5)) ; port RESERVE_3V3.RESERVE_3V3_1
RESERVE_3V3_2: U?#9.T14(IO,_DIFFIO_B36p) ; port RESERVE_3V3.RESERVE_3V3_2
RESERVE_3V3_3: U?#9.T15(IO,_DIFFIO_B36n,_(DQ2B)/(DQ5B)/(DQ5B)) ; port RESERVE_3V3.RESERVE_3V3_3
RESERVE_3V3_4: U?#9.R14(IO,_DIFFIO_B41p) ; port RESERVE_3V3.RESERVE_3V3_4
RESERVE_3V3_5: U?#9.R15(IO,_DIFFIO_B41n) ; port RESERVE_3V3.RESERVE_3V3_5
RESERVE_3V3_6: U?#9.V15(IO,_DIFFIO_B34n,_(DQ2B)/(DQ5B)/(DQ5B)) ; port RESERVE_3V3.RESERVE_3V3_6
RESERVE_3V3_7: U?#9.W15(IO,_DIFFIO_B35p,_(DQ2B)/(DQ5B)/(DQ5B)) ; port RESERVE_3V3.RESERVE_3V3_7
RESERVE_LVDS_0_N: R?#21.2 U?#7.A14(IO,_DIFFIO_T25n,_(PADD9),_(DQ4T)/(DQ5T)/(DQ5T)) ; port RESERVE_LVDS.RESERVE_LVDS_0_N
RESERVE_LVDS_0_P: R?#21.1 U?#7.B14(IO,_DIFFIO_T25p,_(PADD10),_(DQ4T)/(DQ5T)/(DQ5T)) ; port RESERVE_LVDS.RESERVE_LVDS_0_P
RESERVE_LVDS_1_N: R?#22.2 U?#7.A15(IO,_DIFFIO_T27n,_(PADD5),_(DQ4T)/(DQ5T)/(DQ5T)) ; port RESERVE_LVDS.RESERVE_LVDS_1_N
RESERVE_LVDS_1_P: R?#22.1 U?#7.B15(IO,_DIFFIO_T27p,_(PADD6),_(DQ4T)/(DQ5T)/(DQ5T)) ; port RESERVE_LVDS.RESERVE_LVDS_1_P
RESERVE_LVDS_2_N: R?#23.2 U?#7.A16(IO,_DIFFIO_T30n,_(DM2T)/(DM5T/BWS#5T)/(DM5T/BWS#5T)) ; port RESERVE_LVDS.RESERVE_LVDS_2_N
RESERVE_LVDS_2_P: R?#23.1 U?#7.B16(IO,_DIFFIO_T30p,_(DQ4T)/(DQ5T)/(DQ5T)) ; port RESERVE_LVDS.RESERVE_LVDS_2_P
RESERVE_LVDS_3_N: R?#24.2 U?#7.A17(IO,_DIFFIO_T31n,_(PADD1),_(DQ2T)/(DQ5T)/(DQ5T)) ; port RESERVE_LVDS.RESERVE_LVDS_3_N
RESERVE_LVDS_3_P: R?#24.1 U?#7.B17(IO,_DIFFIO_T31p,_(PADD2),__/(DQ5T)/(DQ5T)) ; port RESERVE_LVDS.RESERVE_LVDS_3_P
SCLK: U?#2.D2(IO,_DIFFIO_L5p,_(DQ2L)/(DQ1L)/(DQ1L)) ; port PLL_BUS.SCLK
SDI: U?#2.E1(IO,_DIFFIO_L8n,__/(DQ1L)/(DQ1L)) ; port PLL_BUS.SDI
SDO: U?#2.H2(IO,_DIFFIO_L13p,_(DQ0L)/(DQ1L)/(DQ1L)) ; port PLL_BUS.SDO
STATUS0: U?#2.E3(IO,_DIFFIO_L3n,_(DQ2L)/(DQ1L)/(DQ1L)) ; port PLL_BUS.STATUS0
STATUS1: U?#2.E4(IO,_DIFFIO_L3p,_(nRESET),_(DQ2L)/(DQ1L)/(DQ1L)) ; port PLL_BUS.STATUS1
SYS_~{CS}_N: U?#4.F22(IO,_DIFFIO_R11n,_(DQ0R)/(DQ1R)/(DQ1R)) ; port SYS_SPI_FMC.SYS_~{CS}_N
SYS_~{CS}_P: U?#4.F21(IO,_DIFFIO_R11p,_(DQ0R)/(DQ1R)/(DQ1R)) ; port SYS_SPI_FMC.SYS_~{CS}_P
SYS_CLK: U?#5.AA11(CLK15,_DIFFCLK_6p) ; port SYS_CLK
SYS_DDS_SYNC_N: U?#4.K17(IO,_DIFFIO_R13n) ; port SYS_SPI_FMC.SYS_DDS_SYNC_N
SYS_DDS_SYNC_P: U?#4.K18(IO,_DIFFIO_R13p,_(DQ0R)/(DQ1R)/(DQ1R)) ; port SYS_SPI_FMC.SYS_DDS_SYNC_P
SYS_MISO_0_N: U?#4.F20(IO,_DIFFIO_R6n,_(nAVD),_(DQ2R)/(DQ1R)/(DQ1R)) ; port SYS_SPI_FMC.SYS_MISO_N_0
SYS_MISO_0_P: U?#4.F19(IO,_DIFFIO_R6p,_(DQ2R)/(DQ1R)/(DQ1R)) ; port SYS_SPI_FMC.SYS_MISO_P_0
SYS_MISO_1_N: U?#4.F17(IO,_DIFFIO_R1n,_(DQ2R)/(DQ1R)/(DQ1R)) ; port SYS_SPI_FMC.SYS_MISO_N_1
SYS_MISO_1_P: U?#4.G17(IO,_DIFFIO_R1p) ; port SYS_SPI_FMC.SYS_MISO_P_1
SYS_MISO_2_N: U?#4.G18(IO,_DIFFIO_R5n,_(PADD23),_(DQ2R)/(DQ1R)/(DQ1R)) ; port SYS_SPI_FMC.SYS_MISO_N_2
SYS_MISO_2_P: U?#4.H17(IO,_DIFFIO_R5p) ; port SYS_SPI_FMC.SYS_MISO_P_2
SYS_MISO_3_N: U?#4.H20(IO,_DIFFIO_R9n,_(DQ0R)/(DQ1R)/(DQ1R)) ; port SYS_SPI_FMC.SYS_MISO_N_3
SYS_MISO_3_P: U?#4.H19(IO,_DIFFIO_R9p,_(DQ0R)/(DQ1R)/(DQ1R)) ; port SYS_SPI_FMC.SYS_MISO_P_3
SYS_MOSI_0_N: R?#5.2 U?#4.B22(IO,_DIFFIO_R3n,_(PADD22),_(DQ2R)/(DQ1R)/(DQ1R)) ; port SYS_SPI_FMC.SYS_MOSI_N_0
SYS_MOSI_0_P: R?#5.1 U?#4.B21(IO,_DIFFIO_R3p,_(PADD21),_(DQ2R)/(DQ1R)/(DQ1R)) ; port SYS_SPI_FMC.SYS_MOSI_P_0
SYS_MOSI_1_N: R?#10.2 U?#4.C22(IO,_DIFFIO_R4n,_(DQ2R)/(DQ1R)/(DQ1R)) ; port SYS_SPI_FMC.SYS_MOSI_N_1
SYS_MOSI_1_P: R?#10.1 U?#4.C21(IO,_DIFFIO_R4p,_(DQ2R)/(DQ1R)/(DQ1R)) ; port SYS_SPI_FMC.SYS_MOSI_P_1
SYS_MOSI_2_N: R?#13.2 U?#4.D22(IO,_DIFFIO_R7n,_(DM2R)/(DM1R/BWS#1R)/(DM1R/BWS#1R)) ; port SYS_SPI_FMC.SYS_MOSI_N_2
SYS_MOSI_2_P: R?#13.1 U?#4.D21(IO,_DIFFIO_R7p,__/(DQ1R)/(DQ1R)) ; port SYS_SPI_FMC.SYS_MOSI_P_2
SYS_MOSI_3_N: R?#18.2 U?#4.E22(IO,_DIFFIO_R8n,_(nWE),_(DQ0R)/(DQ1R)/(DQ1R)) ; port SYS_SPI_FMC.SYS_MOSI_N_3
SYS_MOSI_3_P: R?#18.1 U?#4.E21(IO,_DIFFIO_R8p,_(nOE),__/(DQ1R)/(DQ1R)) ; port SYS_SPI_FMC.SYS_MOSI_P_3
SYS_SCLK_N: R?#25.1 U?#5.G21(CLK4,_DIFFCLK_2p) ; port SYS_SPI_FMC.SYS_SCLK_N
SYS_SCLK_P: R?#25.2 U?#5.G22(CLK5,_DIFFCLK_2n) ; port SYS_SPI_FMC.SYS_SCLK_P
TCK: U?#8.L2(TCK) ; port FPGA_SYS.TCK
TDI: U?#8.L5(TDI) ; port FPGA_SYS.TDI
TDO: U?#8.L4(TDO) ; port FPGA_SYS.TDO
TMS: U?#8.L1(TMS) ; port FPGA_SYS.TMS
NetR?#1_7: R?#1.7 U?#1.Y22(IO,_DIFFIO_R35n,_(DQ3R)/(DQ3R)/(DQ1R))
NetR?#2_8: R?#2.8 U?#1.Y21(IO,_DIFFIO_R35p)
NetR?#3_5: R?#3.5 U?#1.W22(IO,_DIFFIO_R32n,_(DQ3R)/(DQ3R)/(DQ1R))
NetR?#4_6: R?#4.6 U?#1.W21(IO,_DIFFIO_R32p,_(DQ3R)/(DQ3R)/(DQ1R))
NetR?#6_7: R?#6.7 U?#1.V22(IO,_DIFFIO_R29n,_(DQ3R)/(DQ3R)/(DQ1R))
NetR?#7_8: R?#7.8 U?#1.V21(IO,_DIFFIO_R29p,_(DQ3R)/(DQ3R)/(DQ1R))
NetR?#8_5: R?#8.5 U?#1.U22(IO,_DIFFIO_R27n,_(DQ3R)/(DQ3R)/(DQ1R))
NetR?#9_6: R?#9.6 U?#1.U21(IO,_DIFFIO_R27p,_(DQ3R)/(DQ3R)/(DQ1R))
NetR?#11_7: R?#11.7 U?#1.R22(IO,_DIFFIO_R24n,_(DQ1R)/(DQ3R)/(DQ1R))
NetR?#12_8: R?#12.8 U?#1.R21(IO,_DIFFIO_R24p,_(DQ1R)/(DQ3R)/(DQ1R))
NetR?#14_5: R?#14.5 U?#1.P22(IO,_DIFFIO_R23n,_(DQ1R)/(DQ3R)/(DQ1R))
NetR?#15_6: R?#15.6 U?#1.P21(IO,_DIFFIO_R23p,_(DQ1R)/(DQ3R)/(DQ1R))
NetR?#16_7: R?#16.7 U?#1.N20(IO,_DIFFIO_R22n,_(DQ1R)/(DQ3R)/(DQ1R))
NetR?#17_8: R?#17.8 U?#1.N19(IO,_DIFFIO_R22p)
NetR?#19_5: R?#19.5 U?#1.M22(IO,_DIFFIO_R19n,_(DQ1R)/(DQ3R)/(DQ1R))
NetR?#20_6: R?#20.6 U?#1.M21(IO,_DIFFIO_R19p,_(DQ1R)/(DQ3R)/(DQ1R))
NetR?#28_8: R?#28.8 U?#10.A3(IO,_DIFFIO_T5n,_(DATA10),_(DQ3T)/(DQ3T)/(DQ5T))
NetR?#29_7: R?#29.7 U?#10.B3(IO,_DIFFIO_T5p,_(DATA11),_(DQ3T)/(DQ3T)/(DQ5T))
NetR?#30_6: R?#30.6 U?#10.C3(IO,_DIFFIO_T3n,_(DQ3T)/(DQ3T)/(DQ5T))
NetR?#31_5: R?#31.5 U?#10.C4(IO,_DIFFIO_T3p,_(DATA12),_(DQS1T/CQ1T#,CDPCLK7)/(DQS1T/CQ1T#,CDPCLK7)/(DQS1T/CQ1T#,CDPCLK7))

Not connected (* = marked no-connect by the designer): U?#1 AA21(IO,_DIFFIO_R36p,_(DM3R/BWS#3R)/(DM3R/BWS#3R)/(DM1R/BWS#1R)) M16(IO) M19(IO,_DIFFIO_R18p,_(DQ1R)/(DQ3R)/(DQ1R)) M20(IO,_DIFFIO_R18n,_(DQ1R)/(DQ3R)/(DQ1R)) N16(IO,_DIFFIO_R25p) N17(IO,_DIFFIO_R21n) N18(IO,_DIFFIO_R21p,_(DQS1R/CQ1R#,DPCLK6)/(DQS1R/CQ1R#,DPCLK6)/(DQS1R/CQ1R#,DPCLK6)) P17(IO,_DIFFIO_R30p) P20(IO,_VREFB5N0) R17(IO,_DIFFIO_R30n) R18(IO,_DIFFIO_R26n) R19(IO,_DIFFIO_R26p,_(DM1R/BWS#1R)/(DM3R/BWS#3R)/(DM1R/BWS#1R)) R20(IO,_DIFFIO_R28n,_(DQ3R)/(DQ3R)/(DQ1R)) T17(IO,_RUP3) T18(IO,_RDN3) T19(IO,_DIFFIO_R31p) T20(IO,_DIFFIO_R31n) U19(IO,_DIFFIO_R34p) U20(IO,_DIFFIO_R34n,_(DQ3R)/(DQ3R)/(DQ1R)) W19(IO,_VREFB5N1) W20(IO,_(DQS3R/CQ3R#,CDPCLK4)/(DQS3R/CQ3R#,CDPCLK4)/(DQS3R/CQ3R#,CDPCLK4)); U?#2 C1(IO,_DIFFIO_L4n,_(DQ2L)/(DQ1L)/(DQ1L)) C2(IO,_DIFFIO_L4p,_(DQS2L/CQ3L,CDPCLK0)/(DQS2L/CQ3L,CDPCLK0)/(DQS2L/CQ3L,CDPCLK0)) G5(IO,_VREFB1N0) H5(IO,_VREFB1N1) H7(IO) J3(IO,_DIFFIO_L14n) J5(IO) J7(IO,_DIFFIO_L11p) K7(IO,_DIFFIO_L11n); U?#3 AA1(IO,_DIFFIO_L31n,_(DQ3L)/(DQ3L)/(DQ1L)) M5(IO,_VREFB2N0) R4(IO,_DIFFIO_L27p) T3(IO,_VREFB2N1) T4(IO,_(DQS3L/CQ3L#,CDPCLK1)/(DQS3L/CQ3L#,CDPCLK1)/(DQS3L/CQ3L#,CDPCLK1)) V3(IO,_RDN1) V4(IO,_RUP1); U?#4 C20(IO,_DIFFIO_R2n,_(PADD20),_(DQS2R/CQ3R,CDPCLK5)/(DQS2R/CQ3R,CDPCLK5)/(DQS2R/CQ3R,CDPCLK5)) D20(IO,_DIFFIO_R2p) H16(IO) H18(IO,_VREFB6N0) H21(IO,_DIFFIO_R14p,_(DQ0R)/(DQ1R)/(DQ1R)) H22(IO,_DIFFIO_R14n,_(DQ0R)/(DQ1R)/(DQ1R)) J17(IO) J18(IO,_DIFFIO_R12n) J19(IO,_DIFFIO_R10p) J20(IO,_DIFFIO_R10n) J21(IO,_DIFFIO_R15p,_(DM0R)/(DM1R/BWS#1R)/(DM1R/BWS#1R)) J22(IO,_DIFFIO_R15n,_(DQS0R/CQ1R,DPCLK7)/(DQS0R/CQ1R,DPCLK7)/(DQS0R/CQ1R,DPCLK7)) K19(IO,_VREFB6N1); U?#5 AA12(CLK13,_DIFFCLK_7p) AB11(CLK14,_DIFFCLK_6n) AB12(CLK12,_DIFFCLK_7n) G1(CLK1,_DIFFCLK_0n) T1(CLK3,_DIFFCLK_1n) T2(CLK2,_DIFFCLK_1p) T21(CLK6,_DIFFCLK_3p) T22(CLK7,_DIFFCLK_3n); U?#6 AA3(IO,_PLL1_CLKOUTp) AA6(IO,_DIFFIO_B5n) AB3(IO,_PLL1_CLKOUTn) AB6(IO,_DIFFIO_B6p) V9(IO,_VREFB3N0) V10(IO,_DIFFIO_B15p,_(DQS3B/CQ3B#,DPCLK2)/(DQS3B/CQ3B#,DPCLK2)/(DQS3B/CQ3B#,DPCLK2)) Y4(IO,_DIFFIO_B3p) Y6(IO,_(DQS1B/CQ1B#,CDPCLK2)/(DQS1B/CQ1B#,CDPCLK2)/(DQS1B/CQ1B#,CDPCLK2)); U?#7 A13(IO,_DIFFIO_T24n,_(PADD11),_(DQ4T)/(DQ5T)/(DQ5T)) A18(IO,_DIFFIO_T34n,_(DQ2T)/(DQ5T)/(DQ5T)) A19(IO,_RDN4) A20(IO,_PLL2_CLKOUTn) B13(IO,_DIFFIO_T24p,_(PADD12),_(DQS4T/CQ5T,DPCLK9)/(DQS4T/CQ5T,DPCLK9)/(DQS4T/CQ5T,DPCLK9)) B18(IO,_DIFFIO_T34p,_(PADD0)) B19(IO,_RUP4) B20(IO,_PLL2_CLKOUTp) C13(IO,_DIFFIO_T26n,_(PADD7)) C15(IO,_VREFB7N1) C17(IO,_DIFFIO_T35p,_(DQ2T)/(DQ5T)/(DQ5T)) C18(IO,_DIFFIO_T39n) C19(IO,_DIFFIO_T37n,_(DQ2T)/(DQ5T)/(DQ5T)) D13(IO,_DIFFIO_T26p,_(PADD8),_(DQ4T)/(DQ5T)/(DQ5T)) D15(IO,_DIFFIO_T33n) D17(IO,_VREFB7N0) D18(IO,_DIFFIO_T39p) D19(IO,_DIFFIO_T37p,_(DQ2T)/(DQ5T)/(DQ5T)) E11(IO,_DIFFIO_T23n,_(PADD13)) E12(IO,__/(DQ5T)/(DQ5T)) E13(IO) E14(IO,_DIFFIO_T28n,_(PADD3),_(DQ4T)/(DQ5T)/(DQ5T)) E15(IO,_DIFFIO_T33p,_(DQ2T)/(DQ5T)/(DQ5T)) E16(IO,_DIFFIO_T42p,_(DQ2T)/(DQ5T)/(DQ5T)) F11(IO,_DIFFIO_T23p,_(PADD14),_(DM4T)/(DM5T/BWS#5T)/(DM5T/BWS#5T)) F13(IO,_DIFFIO_T28p,_(PADD4),_(DQS2T/CQ3T,DPCLK8)/(DQS2T/CQ3T,DPCLK8)/(DQS2T/CQ3T,DPCLK8)) F14(IO,_DIFFIO_T40p,_(DQS0T/CQ1T,CDPCLK6)/(DQS0T/CQ1T,CDPCLK6)/(DQS0T/CQ1T,CDPCLK6)) F15(IO,_DIFFIO_T41n,_(DQ2T)/(DQ5T)/(DQ5T)) F16(IO,_DIFFIO_T42n) G13(IO,_DIFFIO_T32p) G14(IO,_DIFFIO_T32n) G15(IO,_DIFFIO_T40n) G16(IO,_DIFFIO_T41p); U?#9 AA17(IO,_DIFFIO_B37p) AA18(IO,_VREFB4N0) AA19(IO,_RUP2) AB17(IO,_DIFFIO_B37n) AB19(IO,_RDN2) R16(IO,_PLL4_CLKOUTn) T16(IO,_PLL4_CLKOUTp) U16(IO,_DIFFIO_B40p) U17(IO,_DIFFIO_B40n) V12(IO,_VREFB4N1) V16(IO) W14(IO,_DIFFIO_B31n) Y14(IO,_DIFFIO_B29p) Y15(IO,_DIFFIO_B29n); U?#10 A9(IO,_DIFFIO_T20n,_(PADD16),_(DQ5T)/(DQ3T)/(DQ5T)) A10(IO,_DIFFIO_T21n,_(DQ5T)/(DQ3T)/(DQ5T)) B5(IO,_VREFB8N1) B8(IO,_DIFFIO_T17p,_(DATA3),_(DQ5T)/(DQ3T)/(DQ5T)) B9(IO,_DIFFIO_T20p,_(PADD17),_(DQS5T/CQ5T#,DPCLK10)/(DQS5T/CQ5T#,DPCLK10)/(DQS5T/CQ5T#,DPCLK10)) B10(IO,_DIFFIO_T21p,_(PADD15)) C6(IO,_DIFFIO_T9n,_(DATA7),_(DQ3T)/(DQ3T)/(DQ5T)) C7(IO,_DIFFIO_T13p,_(DATA13),_(DM5T/BWS#5T)/(DM3T/BWS#3T)/(DM5T/BWS#5T)) C8(IO,_DIFFIO_T13n,_(DATA14),_(DQS3T/CQ3T#,DPCLK11)/(DQS3T/CQ3T#,DPCLK11)/(DQS3T/CQ3T#,DPCLK11)) C10(IO,_VREFB8N0) D6(IO,_DIFFIO_T4n) D7(IO,_DIFFIO_T9p) D8(IO,_DIFFIO_T12n) D10(IO,_DIFFIO_T22n,_(DQ5T)/(DQ3T)/(DQ5T)) E7(IO,_DIFFIO_T4p) E8(IO,_DIFFIO_T12p) E9(IO,_DIFFIO_T14n) E10(IO,_DIFFIO_T22p) F7(IO,_DIFFIO_T2n,_(DM3T/BWS#3T)/(DM3T/BWS#3T)/(DM5T/BWS#5T)) F8(IO,_DIFFIO_T7n,_(DATA9),_(DQ3T)/(DQ3T)/(DQ5T)) F9(IO) F10(IO,_DIFFIO_T10p,_(DATA6),_(DQ3T)/(DQ3T)/(DQ5T)) G7(IO,_DIFFIO_T2p) G8(IO,_DIFFIO_T7p) G9(IO,_DIFFIO_T1n) G10(IO,_DIFFIO_T10n) G11(IO,_DIFFIO_T18n); U?#11 E17(VCCD_PLL2) E18(GNDA2) F5(GNDA3) F6(VCCD_PLL3) F18(VCCA2) G6(VCCA3) T6(VCCA1) U5(GNDA1) U6(VCCD_PLL1) U18(VCCA4) V17(VCCD_PLL4) V18(GNDA4); U?#12 A2(VCCIO8) A21(VCCIO7) AB2(VCCIO3) AB21(VCCIO4) D4(VCCIO1) D5(VCCIO8) D9(VCCIO8) D11(VCCIO8) D12(VCCIO7) D14(VCCIO7) D16(VCCIO7) E19(VCCIO6) F4(VCCIO1) G12(VCCINT) G19(VCCIO6) H9(VCCINT) H11(VCCINT) H15(VCCINT) J8(VCCINT) J10(VCCINT) J11(VCCINT) J12(VCCINT) J13(VCCINT) J14(VCCINT) J16(VCCINT) K4(VCCIO1) K8(VCCINT) K9(VCCINT) K14(VCCINT) K15(VCCINT) L7(VCCINT) L9(VCCINT) L14(VCCINT) L16(VCCINT) L19(VCCIO6) M8(VCCINT) M9(VCCINT) M14(VCCINT) M15(VCCINT) N4(VCCIO2) N9(VCCINT) N14(VCCINT) P9(VCCINT) P10(VCCINT) P11(VCCINT) P12(VCCINT) P13(VCCINT) P14(VCCINT) P15(VCCINT) P18(VCCIO5) R8(VCCINT) R10(VCCINT) R12(VCCINT) T7(VCCINT) T9(VCCINT) T13(VCCINT) U4(VCCIO2) V19(VCCIO5) W4(VCCIO2) W5(VCCIO3) W9(VCCIO3) W11(VCCIO3) W12(VCCIO4) W16(VCCIO4) W18(VCCIO4) Y19(VCCIO5); U?#13 A1(GND) A22(GND) AA2(GND) AA22(GND) AB1(GND) AB22(GND) C5(GND) C9(GND) C11(GND) C12(GND) C14(GND) C16(GND) D3(GND) E20(GND) F3(GND) F12(GND) G2(GND) G20(GND) H8(GND) H10(GND) H12(GND) H13(GND) H14(GND) J9(GND) J15(GND) K3(GND) K10(GND) K11(GND) K12(GND) K13(GND) K16(GND) L8(GND) L10(GND) L11(GND) L12(GND) L13(GND) L15(GND) L20(GND) M7(GND) M10(GND) M11(GND) M12(GND) M13(GND) N3(GND) N8(GND) N10(GND) N11(GND) N12(GND) N13(GND) N15(GND) P8(GND) P16(GND) P19(GND) R7(GND) R9(GND) R11(GND) R13(GND) T8(GND) T12(GND) U3(GND) V20(GND) W3(GND) Y5(GND) Y9(GND) Y11(GND) Y12(GND) Y16(GND) Y18(GND) Y20(GND)

## Buses and harness runs
bus fmc_io_in[0..7]
bus fmc_io_out[0..7]
bus io_in[0..7]
bus io_out[0..7]
bus LED[0..3] = port LED[0..3]
harness DDS_BUS_1 = port DDS_BUS_1
harness DDS_BUS_2 = port DDS_BUS_2
harness RIO_FMC = port RIO_FMC
harness SYS_SPI_FMC = port SYS_SPI_FMC

## Layout directives
differential pair: 100MHz_CLK_IN_N, 100MHz_CLK_IN_P, CLK_REFB_N, CLK_REFB_P, DDS_CLK_IN_N, DDS_CLK_IN_P, PLL3_OUT_N, PLL3_OUT_P, RESERVE_LVDS_0_N, RESERVE_LVDS_0_P, RESERVE_LVDS_1_N, RESERVE_LVDS_1_P, RESERVE_LVDS_2_N, RESERVE_LVDS_2_P, RESERVE_LVDS_3_N, RESERVE_LVDS_3_P, SYS_DDS_SYNC_N, SYS_DDS_SYNC_P, SYS_MISO_0_N, SYS_MISO_0_P, SYS_MISO_1_N, SYS_MISO_1_P, SYS_MISO_2_N, SYS_MISO_2_P, SYS_MISO_3_N, SYS_MISO_3_P, SYS_MOSI_0_N, SYS_MOSI_0_P, SYS_MOSI_1_N, SYS_MOSI_1_P, SYS_MOSI_2_N, SYS_MOSI_2_P, SYS_MOSI_3_N, SYS_MOSI_3_P, SYS_SCLK_N, SYS_SCLK_P, SYS_~{CS}_N, SYS_~{CS}_P
net class dds_bus_1_1: DDS_BUS_1.P1D0, DDS_BUS_1.P1D1, DDS_BUS_1.P1D2, DDS_BUS_1.P1D3, DDS_BUS_1.P1D4, DDS_BUS_1.P1D5, DDS_BUS_1.P1D6, DDS_BUS_1.P1D7, DDS_BUS_1.P1D8, DDS_BUS_1.P1D9, DDS_BUS_1.P1D10, DDS_BUS_1.P1D11, DDS_BUS_1.P1D12, DDS_BUS_1.P1D13
net class dds_bus_1_2: DDS_BUS_1.P2D0, DDS_BUS_1.P2D1, DDS_BUS_1.P2D2, DDS_BUS_1.P2D3, DDS_BUS_1.P2D4, DDS_BUS_1.P2D5, DDS_BUS_1.P2D6, DDS_BUS_1.P2D7, DDS_BUS_1.P2D8, DDS_BUS_1.P2D9, DDS_BUS_1.P2D10, DDS_BUS_1.P2D11, DDS_BUS_1.P2D12, DDS_BUS_1.P2D13
net class dds_bus_2_1: DDS_BUS_2.P1D0, DDS_BUS_2.P1D1, DDS_BUS_2.P1D2, DDS_BUS_2.P1D3, DDS_BUS_2.P1D4, DDS_BUS_2.P1D5, DDS_BUS_2.P1D6, DDS_BUS_2.P1D7, DDS_BUS_2.P1D8, DDS_BUS_2.P1D9, DDS_BUS_2.P1D10, DDS_BUS_2.P1D11, DDS_BUS_2.P1D12, DDS_BUS_2.P1D13
net class dds_bus_2_2: DDS_BUS_2.P2D0, DDS_BUS_2.P2D1, DDS_BUS_2.P2D2, DDS_BUS_2.P2D3, DDS_BUS_2.P2D4, DDS_BUS_2.P2D5, DDS_BUS_2.P2D6, DDS_BUS_2.P2D7, DDS_BUS_2.P2D8, DDS_BUS_2.P2D9, DDS_BUS_2.P2D10, DDS_BUS_2.P2D11, DDS_BUS_2.P2D12, DDS_BUS_2.P2D13

## Notes on the sheet
- Internal bus
- PLL_100MHz_IN
- DDS_CLK_200MHz_IN
- 2V5
- Alternative CLK_10MHz
- (near R?#33) mini-LVDS_E_3R  I/O Standard
- Перв. примен.
- Справ. №
- Подп. и дата
- Инв. № дубл.
- Взам. инв. №
- Инв. № подл.
- Изм.
- Лист
- № докум.
- Подп.
- Дата
- Форма 2а ГОСТ 2.104-2006
- Копировал
- Формат А2
- (in symbol EP4CE55-F484, part A) BANK 1
- (in symbol EP4CE55-F484, part B) BANK 2
- (in symbol EP4CE55-F484, part C) BANK 3
- (in symbol EP4CE55-F484, part D) BANK 4
- (in symbol EP4CE55-F484, part E) BANK 5
- (in symbol EP4CE55-F484, part F) BANK 6
- (in symbol EP4CE55-F484, part G) BANK 7
- (in symbol EP4CE55-F484, part H) BANK 8

## Library data of the parts
C?#1-C?#4 = Capacitor: Назначение: SMD-конденсатор; Наименование: GRM033D70J105ME01; Потребление, Вт: 0; Value: 1мкФ 6.3В X7T
R?#1-R?#4 R?#6-R?#9 R?#11 R?#12 R?#14-R?#17 R?#19 R?#20 R?#28-R?#31 = Resistor-4: Потребление, Вт: 0.0; Наименование: TC124-FR-0733RL; Назначение: 4 Chip Resistor Array; Описание: TC124-FR-0733RL
R?#5 R?#10 R?#13 R?#18 R?#21-R?#27 R?#32-R?#34 = Resistor: Наименование: Резистор; Назначение: SMD-резистор; Потребление, Вт: 0,001
  R?#5 R?#10 R?#13 R?#18 R?#21-R?#27 R?#32 R?#34: Value: 100
  R?#33: Value: 200
U?#1-U?#13 = EP4CE55-F484: Cyclone IV Family FPGA, 1.2V Core, 324 I/O Pins, 4 PLLs, 484-Pin FBGA, Speed Grade 8, Commercial Grade; Manufacturer: Altera; Потребление, Вт: 0,4; PackageDescription: 484-Pin FineLine Ball Grid Array (FBGA) - Wire Bond - A:2.40; ComponentLink2Description: Handbook; Code_JEDEC: MS-034-AAJ-1; ComponentLink2URL: http://www.altera.com/literature/hb/cyclone-iv/cyclone4-handbook.pdf; ComponentLink1URL: http://www.altera.com/; PackageVersion: ver1.0, Jun-2011; ComponentLink3URL: http://www.altera.com/literature/lit-dp.jsp?category=cyc%204&showspreadsheet=y; ComponentLink4Description: Package Specification; ComponentLink4URL: http://www.altera.com/devicepackaging/04R00247-02.pdf; ComponentLink1Description: Manufacturer URL; RevisionNote: DatasheetVersion updated. URLs added. PCB updated.; PackageReference: FBGA484_A-240; DatasheetVersion: ver1.6, Nov-2011; ComponentLink3Description: Pinout; Назначение: Cyclone IV Family FPGA, 1.2V Core, 324 I/O Pins, 4 PLLs, 484-Pin FBGA, Speed Grade 8, Commercial Grade; Наименование: EP4CE55F23C8